# Altium project lab2_zhernakov_buck.PrjPcb
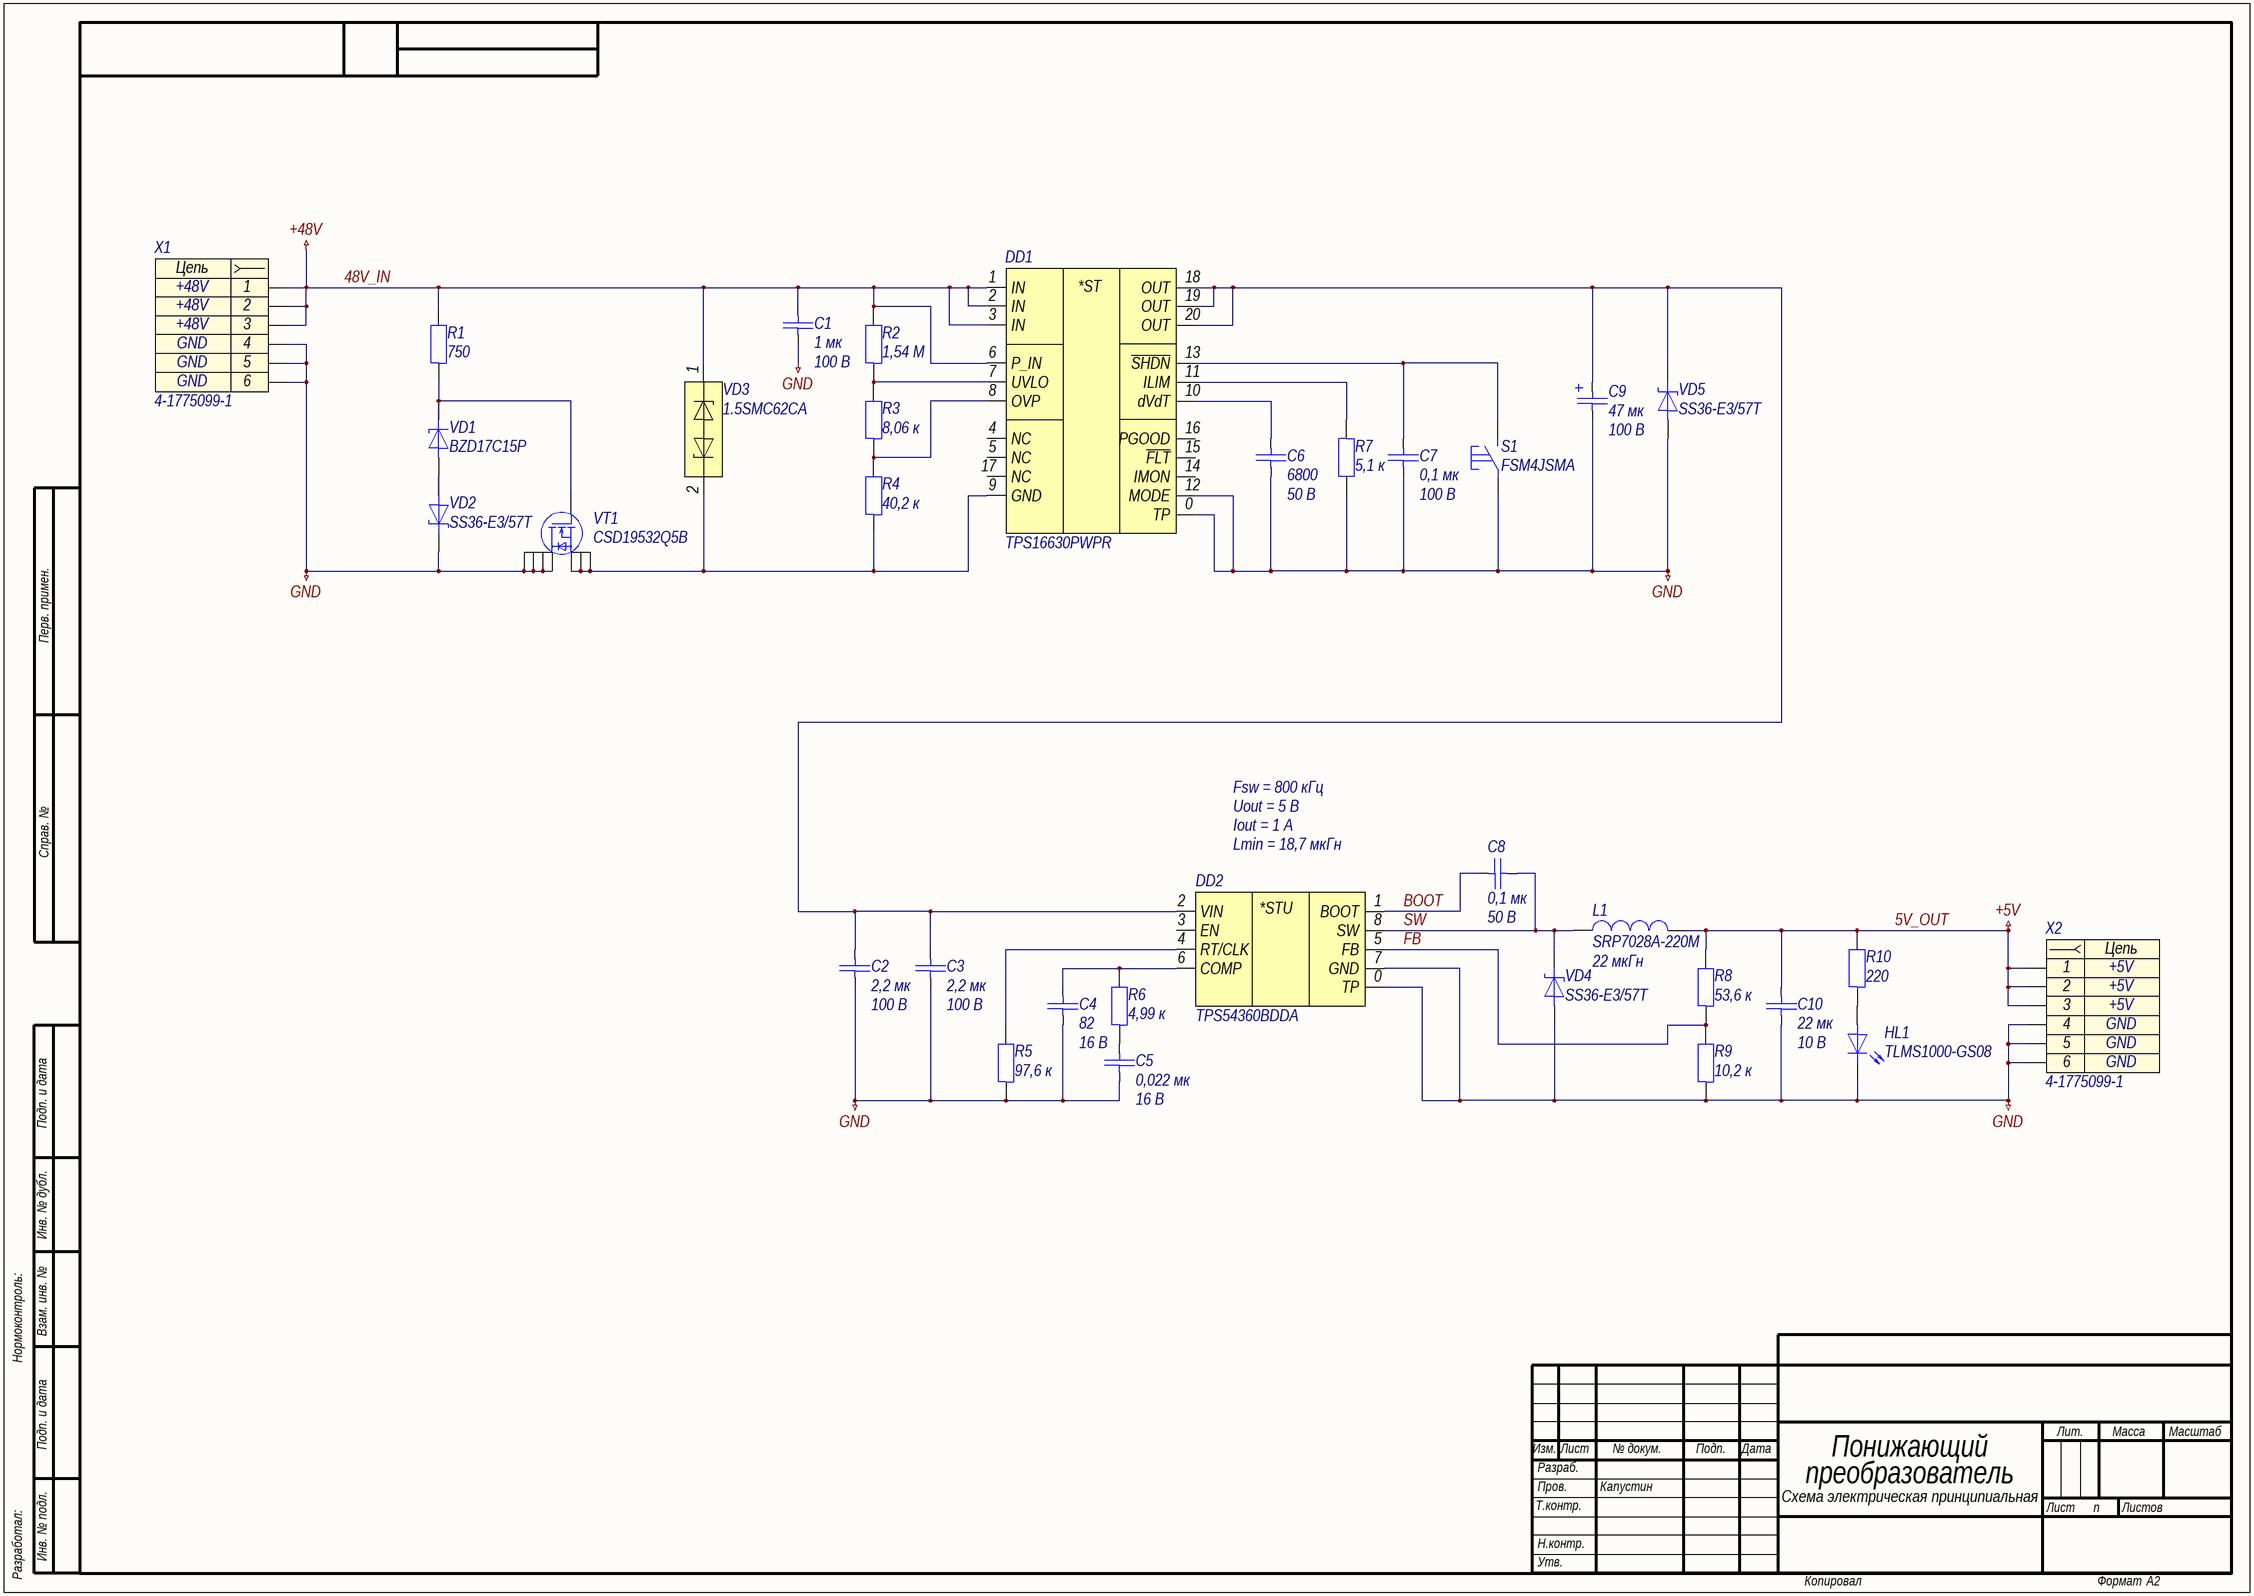
[diagram p0: lab2_zhernakov_buck.SchDoc]
approver: Капустин; check: Капустин; designation: СПБПУ.3331506.005; developer: Жернаков; document_code: Ý3; document_type: Схема электрическая принципиальная; pcb_dec_number: СПБПУ.3331506.005; project: Понижающий преобразователь; sheets_total: 1; title: Понижающий преобразователь; title_line_1: Понижающий; title_line_2: преобразователь
1 sheet, 33 parts. Net scope: global (net labels, ports and power ports of the same name join across sheets).
Board file: lab2_zhernakov_buck.PcbDoc

## Sheet lab2_zhernakov_buck.SchDoc: Понижающий преобразователь
size 594 x 420 mm; ApprovedBy: Капустин; CheckedBy: Капустин; DrawnBy: Жернаков; DocumentNumber: СПБПУ.3331506.005Ý3; SheetNumber: n; SheetTotal: 1; DocumentCode: Ý3; ImagePath: СПБПУ.3331506.005

### Parts
C1  1 мк  Напряжение: 100 В  [C1206]
C2  2,2 мк  Напряжение: 100 В  [C1206]
C3  2,2 мк  Напряжение: 100 В  [C1206]
C4  82  Напряжение: 16 В  [C0603]
C5  0,022 мк  Напряжение: 16 В  [C0201]
C6  6800  Напряжение: 50 В  [C0402]
C7  0,1 мк  Напряжение: 100 В  [C0603]
C8  0,1 мк  Напряжение: 50 В  [C0603]
C9  47 мк  Напряжение: 100 В  [CAPAE-1000X1000X1200]
C10  22 мк  Напряжение: 10 В  [C0603]
DD1  TPS16630PWPR  [HTSSOP-20]
DD2  TPS54360BDDA  [HSOIC-8]
HL1  TLMS1000-GS08  [HL0603]
L1  SRP7028A-220M  Индуктивность: 22 мкГн  [SRP-2-670X660X280]
R1  750  [R0603]
R2  1,54 М  [R0603]
R3  8,06 к  [R0603]
R4  40,2 к  [R0603]
R5  97,6 к  [R0603]
R6  4,99 к  [R0603]
R7  5,1 к  [R0603]
R8  53,6 к  [R0603]
R9  10,2 к  [R0603]
R10  220  [R0603]
S1  FSM4JSMA  [FSM4JSMA]
VD1  BZD17C15P  [DO-219AB]
VD2  SS36-E3/57T  [DO-214AB]
VD3  1.5SMC62CA  [DO-214AB]
VD4  SS36-E3/57T  [DO-214AB]
VD5  SS36-E3/57T  [DO-214AB]
VT1  CSD19532Q5B  [SON-8]
X1  4-1775099-1  [4-1775099-1]
X2  4-1775099-1  [4-1775099-1]

### Nets
5V_OUT: C10.1 L1.2 R8.2 R10.2 X2.1 X2.2 X2.3  [also labelled +5V]
48V_IN: C1.1 DD1.1(IN) DD1.2(IN) DD1.3(IN) DD1.6(P_IN) R1.2 R2.2 VD3.1 X1.1 X1.2 X1.3  [also labelled +48V]
GND: C1.2 C2.2 C3.2 C4.2 C5.2 C6.2 C7.2 C9.2 C10.2 DD1.0(TP) DD1.12(MODE) DD2.0(TP) DD2.7(GND) HL1.1 R5.1 R7.2 R9.1 S1.1 VD2.1 VD4.2 VD5.2 VT1.D X1.4 X1.5 X1.6 X2.4 X2.5 X2.6
BOOT: C8.2 DD2.1(BOOT)
FB: DD2.5(FB) R8.1 R9.2
SW: C8.1 DD2.8(SW) L1.1 VD4.1
NetC2_1: C2.1 C3.1 C9.1 DD1.18(OUT) DD1.19(OUT) DD1.20(OUT) DD2.2(VIN) VD5.1
NetC4_1: C4.1 DD2.6(COMP) R6.2
NetC5_1: C5.1 R6.1
NetC6_1: C6.1 DD1.10(dVdT)
NetC7_1: C7.1 DD1.13(~{SHDN}) S1.2
NetDD1_7: DD1.7(UVLO) R2.1 R3.2
NetDD1_8: DD1.8(OVP) R3.1 R4.2
NetDD1_9: DD1.9(GND) R4.1 VD3.2 VT1.S
NetDD1_11: DD1.11(ILIM) R7.1
NetDD2_4: DD2.4(RT/CLK) R5.2
NetHL1_2: HL1.2 R10.1
NetR1_1: R1.1 VD1.1 VT1.G
NetVD1_2: VD1.2 VD2.2

Not connected (* = marked no-connect by the designer): DD1 4(NC) 5(NC) 14(IMON) 15(~{FLT}) 16(PGOOD) 17(NC); DD2 3(EN)

### Notes on the sheet
- Fsw = 800 кГц
- Uout = 5 В
- Iout = 1 А
- Lmin = 18,7 мкГн
- Перв. примен.
- Справ. №
- Подп. и дата
- Инв. № дубл.
- Нормоконтроль:
- Взам. инв. №
- Изм.
- Лист
- № докум.
- Подп.
- Дата
- Лит.
- Масса
- Масштаб
- Т.контр.
- Пров.
- Разраб.
- Листов
- Разработал:
- Инв. № подл.
- Н.контр.
- Утв.
- Копировал
- Формат
- А2
- (in symbol dd0002) *STU; *ST
- (in symbol x0005) Цепь

### Library data of the parts
C1 = c0068: =Описание; ID: c0068; Фамилия: Ларионов; Описание: Конденсатор чип 1206 1 мкФ 100 В ±10 %; Наименование: CC1206KKX7R0BB105; Производитель: YAGEO Corp.; Отклонение: ±10 %; Рабочие температуры: от –55 °С до +125 °С; Температурный коэффициент емкости: X7R; Корпус: 1206; Номинал: 1 мк; Номинальное напряжение: 100 В; HelpURL: https://www.yageo.com/upload/media/product/productsearch/datasheet/mlcc/UPY-NP0X7R_MV_100-to-630V_22.pdf
C2 C3 = c0068: =Описание; ID: c0068; Фамилия: Ларионов; Описание: Конденсатор чип 1206 2,2 мкФ 100 В ±10 %; Наименование: CC1206KKX7R0BB225; Производитель: YAGEO Corp.; Отклонение: ±10 %; Рабочие температуры: от –55 °С до +125 °С; ТКЕ: X7R; Корпус: 1206; Номинал: 2,2 мк; Номинальное напряжение: 100 В; HelpURL: https://www.yageo.com/upload/media/product/productsearch/datasheet/mlcc/UPY-NP0X7R_MV_100-to-630V_22.pdf
C4 = c0011: =Описание; ID: c0011; Фамилия: Ларионов; Описание: Конденсатор чип 0603 82 пФ 16 В ±5 %; Наименование: CC0603JRNPO7BN820; Производитель: YAGEO Corp.; Отклонение: ±5 %; Рабочие температуры: от –55 °С до +125 °С; Температурный коэффициент емкости: C0G; Корпус: 0603; Номинал: 82; Номинальное напряжение: 16 В; HelpURL: https://www.yageo.com/upload/media/product/productsearch/datasheet/mlcc/UPY-GP_NP0_16V-to-50V_18.pdf
C5 = c0024: =Описание; ID: c0024; Фамилия: Жернаков; Описание: Конденсатор чип 0201 22 нФ 16 В ±10 %; Наименование: CC0201KRX5R7BB223; Производитель: YAGEO Corp.; Отклонение: ±10 %; Рабочие температуры: от –55 °С до +85 °С; Температурный коэффициент емкости: X5R; Корпус: 0201; Номинал: 0,022 мк; Номинальное напряжение: 16 В; HelpURL: https://www.yageo.com/upload/media/product/productsearch/datasheet/mlcc/UPY-GPHC_X5R_4V-to-50V_26.pdf
C6 = c0005: =Описание; ID: c0005; Фамилия: Жернаков; Описание: Конденсатор чип 0402 6,8 нФ 50 В ±5 %; Наименование: CL05B682JB5NNNC; Производитель: Samsung electro-mechanics; Отклонение: ±5 %; Рабочие температуры: от –55 °С до +125 °С; Температурный коэффициент емкости: C0G; Корпус: 0402; Номинал: 6800; Номинальное напряжение: 50 В; HelpURL: http://product.samsungsem.com/mlcc/CL05B682JB5NNN.do
C7 = c0038: =Описание; ID: c0038; Фамилия: Ларионов; Описание: Конденсатор чип 0603 100 нФ 100 В ±10 %; Наименование: CC0603KRX7R0BB104; Производитель: YAGEO Corp.; Отклонение: ±10 %; Рабочие температуры: от –55 °С до +125 °С; Температурный коэффициент емкости: X7R; Корпус: 0603; Номинал: 0,1 мк; Номинальное напряжение: 100 В; HelpURL: https://www.yageo.com/upload/media/product/productsearch/datasheet/mlcc/UPY-NP0X7R_MV_100-to-630V_22.pdf
C8 = c0027: =Описание; ID: c0027; Фамилия: Паньков; Описание: Конденсатор чип 0603 0,1 мкФ 50 В ±10 %; Наименование: CC0603KRX7R9BB104; Производитель: YAGEO Corp.; Отклонение: ±10 %; Рабочие температуры: от –55 °С до +125 °С; ТКЕ: X7R; Корпус: 0603; Номинал: 0,1 мк; Номинальное напряжение: 50 В; HelpURL: https://www.yageo.com/upload/media/product/products/datasheet/mlcc/UPY-GPHC_X7R_6.3V-to-50V_20.pdf
C9 = c0118: =Описание; ID: c0118; Фамилия: Ларионов; Описание: Конденсатор электролитический 47 мкФ 100 В ±20 %; Наименование: MAL214699904E3; Производитель: Vishay Intertechnology, Inc.; Отклонение: ±20 %; Рабочие температуры: от –55 °С до +125 °С; Корпус: CAPAE (10 x 10 x 12); Номинал: 47 мк; Номинальное напряжение: 100 В; Температурный коэффициент емкости: -; HelpURL: https://www.vishay.com/capacitors/list/product-28403/
C10 = c0101: =Описание; ID: c0101; Фамилия: Чернов; Описание: Конденсатор чип 0603 22 мкФ 10 В ±20 %; Наименование: CC0603MPX5R6BB226; Производитель: YAGEO Corp.; Отклонение: ±20 %; Рабочие температуры: от –55 °С до +85 °С; Температурный коэффициент емкости: X5R; Корпус: 0603; Номинал: 22 мк; Номинальное напряжение: 10 В; HelpURL: https://www.yageo.com/upload/media/product/productsearch/datasheet/mlcc/UPY-GPHC_X5R_4V-to-50V_26.pdf
DD1 = dd0002: =Описание; ID: dd0002; Фамилия: Жернаков; Описание: Защитная микросхема eFuse 60 В и 6 А; Производитель: Texas Instruments; Напряжение: от 4,5 В до 60 В; Максимальное напряжение: 67 В; Ток: от 0,6 А до 6 А; Рабочие температуры: от -40 °С до +125 °С; Наименование: TPS16630PWPR; Корпус: HTSSOP-20; HelpURL: https://www.ti.com/product/TPS1663
DD2 = dd0002: =Описание; ID: dd0002; Фамилия: Жернаков; Описание: Понижающий преобразователь напряжения 60 В и 3,5 А; Производитель: Texas Instruments; Входное напряжение: от 4,5 В до 60 В; Выходное напряжение: от 1 В до 58,8 В; Коммутируемый ток: от 0 А до 3,5 А; Частота переключения: от 100 кГц до 2,5 МГц; Рабочие температуры: от -40 °С до +150 °С; Наименование: TPS54360BDDA; Корпус: HSOIC-8; HelpURL: https://www.ti.com/product/TPS54360B#product-details##params
HL1 = hl0001: =Описание; ID: hl0001; Фамилия: Ларионов; Описание: Светодиод чип 0603 красный; Производитель: Vishay Intertechnology, Inc.; Цвет: Red; Номинальная сила света: 4 мкд; Номинальная длина волны: 628 нм; Номинальный прямой ток: 15 мА; Номинальное падение напряжения: 1,8 В; Рассеиваемая мощность: 40 мВт; Рабочие температуры: от -40 °С до +100 °С; Корпус: 0603; Наименование: TLMS1000-GS08; HelpURL: https://www.vishay.com/leds/list/product-83172/
L1 = l0006: =Описание; ID: l0006; Фамилия: Ларионов; Описание: Катушка индуктивности 22 мкГн ±20 %; Производитель: Bourns, Inc.; Отклонение: ±20 %; Номинальное активное сопротивление: 165 мОм; Максимальное активное сопротивление: 190 мОм; Резонансная частота: 10 МГц; Номинальный ток (при нагреве на 20 °С/40 °С): 2 А; Ток насыщения: 3,5 А; Рабочее напряжение: не указано; Рабочие температуры: от –55 °С до +150 °С; Корпус: 6,7 x 6,6 x 2,8; Наименование: SRP7028A-220M; Номинал: 22 мкГн; HelpURL: https://www.bourns.com/products/magnetic-products/power-inductors-aec-q200-compliant/product/SRP7028A
R1 = r0028: =Описание; ID: r0028; Фамилия: Паньков; Описание: Резистор чип 0603 750 Ом ±1 % 0,1 Вт; Наименование: RC0603FR-07750RL; Производитель: YAGEO Corp.; Отклонение: ±1 %; Номинальное напряжение: 75 В; Рабочие температуры: от –55 °С до +155 °С; Номинальный ток: 1 А; Корпус: 0603; Номинал: 750; HelpURL: https://www.yageo.com/upload/media/product/productsearch/datasheet/rchip/PYu-RC_Group_51_RoHS_L_11.pdf
R2 = r0042: =Описание; ID: r0042; Фамилия: Жернаков; Описание: Резистор чип 0603 1,54 МОм ±1 % 0,1 Вт; Наименование: RC0603FR-071M54L; Производитель: YAGEO Corp.; Отклонение: ±1 %; Номинальное напряжение: 75 В; Рабочие температуры: от -55 °С до +155 °С; Номинальный ток: 1 А; Корпус: 0603; Номинал: 1,54 М; HelpURL: https://www.yageo.com/upload/media/product/productsearch/datasheet/rchip/PYu-RC_Group_51_RoHS_L_11.pdf
R3 = r0020: =Описание; ID: r0020; Фамилия: Жернаков; Описание: Резистор чип 0603 8,06 кОм ±1 % 0,1 Вт; Наименование: RC0603FR-078K06L; Производитель: YAGEO Corp.; Отклонение: ±1 %; Номинальное напряжение: 75 В; Рабочие температуры: от -55 °С до +155 °С; Номинальный ток: 1 А; Корпус: 0603; Номинал: 8,06 к; HelpURL: https://www.yageo.com/upload/media/product/productsearch/datasheet/rchip/PYu-RC_Group_51_RoHS_L_11.pdf
R4 = r0028: =Описание; ID: r0028; Фамилия: Жернаков; Описание: Резистор чип 0603 40,2 кОм ±1 % 0,1 Вт; Наименование: RC0603FR-0740K2L; Производитель: YAGEO Corp.; Отклонение: ±1 %; Номинальное напряжение: 75 В; Рабочие температуры: от -55 °С до +155 °С; Номинальный ток: 1 А; Корпус: 0603; Номинал: 40,2 к; HelpURL: https://www.yageo.com/upload/media/product/productsearch/datasheet/rchip/PYu-RC_Group_51_RoHS_L_11.pdf
R5 = r0029: =Описание; ID: r0029; Фамилия: Водорезов; Описание: Резистор чип 0603 97,6 кОм ±1 % 0,1 Вт; Наименование: RC0603FR-0797K6L; Производитель: YAGEO Corp.; Отклонение: ±1 %; Номинальное напряжение: 75 В; Рабочие температуры: от -55 °С до +155 °С; Номинальный ток: 1 А; Корпус: 0603; Номинал: 97,6 к; HelpURL: https://www.yageo.com/upload/media/product/productsearch/datasheet/rchip/PYu-RC_Group_51_RoHS_L_11.pdf
R6 = r0017: =Описание; ID: r0017; Фамилия: Жернаков; Описание: Резистор чип 0603 4,99 кОм ±1 % 0,1 Вт; Наименование: RC0603FR-074K99L; Производитель: YAGEO Corp.; Отклонение: ±1 %; Номинальное напряжение: 75 В; Рабочие температуры: от -55 °С до +155 °С; Номинальный ток: 1 А; Корпус: 0603; Номинал: 4,99 к; HelpURL: https://www.yageo.com/upload/media/product/productsearch/datasheet/rchip/PYu-RC_Group_51_RoHS_L_11.pdf
R7 = r0019: =Описание; ID: r0019; Фамилия: Жернаков; Описание: Резистор чип 0603 5,1 кОм ±1 % 0,1 Вт; Наименование: RC0603FR-075K1L; Производитель: YAGEO Corp.; Отклонение: ±1 %; Номинальное напряжение: 75 В; Рабочие температуры: от -55 °С до +155 °С; Номинальный ток: 1 А; Корпус: 0603; Номинал: 5,1 к; HelpURL: https://www.yageo.com/upload/media/product/productsearch/datasheet/rchip/PYu-RC_Group_51_RoHS_L_11.pdf
R8 = r0017: =Описание; ID: r0017; Фамилия: Жернаков; Описание: Резистор чип 0603 53,6 кОм ±0,1 % 0,1 Вт; Наименование: RC0603BR-0753K6L; Производитель: YAGEO Corp.; Отклонение: ±0,1 %; Номинальное напряжение: 75 В; Рабочие температуры: от -55 °С до +155 °С; Номинальный ток: 1 А; Корпус: 0603; Номинал: 53,6 к; HelpURL: https://www.yageo.com/upload/media/product/productsearch/datasheet/rchip/PYu-RC_Group_51_RoHS_L_11.pdf
R9 = r0014: =Описание; ID: r0014; Фамилия: Жернаков; Описание: Резистор чип 0603 10,2 кОм ±1 % 0,1 Вт; Наименование: RC0603FR-0710K2L; Производитель: YAGEO Corp.; Отклонение: ±1 %; Номинальное напряжение: 75 В; Рабочие температуры: от -55 °С до +155 °С; Номинальный ток: 1 А; Корпус: 0603; Номинал: 10,2 к; HelpURL: https://www.yageo.com/upload/media/product/productsearch/datasheet/rchip/PYu-RC_Group_51_RoHS_L_11.pdf
R10 = r0009: =Описание; ID: r0009; Фамилия: Ларионов; Описание: Резистор чип 0603 220 Ом ±1 % 0,1 Вт; Наименование: RC0603FR-07220RL; Производитель: YAGEO Corp.; Отклонение: ±1 %; Номинальное напряжение: 75 В; Рабочие температуры: от -55 °С до +155 °С; Номинальный ток: 1 А; Корпус: 0603; Номинал: 220; HelpURL: https://www.yageo.com/upload/media/product/productsearch/datasheet/rchip/PYu-RC_Group_51_RoHS_L_11.pdf
S1 = sw0001: =Описание; ID: sw0001; Фамилия: Паньков; Описание: Тактовая кнопка поверхностного монтажа; Производитель: TE Connectivity; Ток нагрузки: 50 мА @ 24 В; Сопротивление контакта: 100 мОм; Количество контактов: 4; Рабочие температуры: от –35 °С до +85 °С; Промывка: Разрешена; Корпус: 6,00x6,00x4,98; Наименование: FSM4JSMA; HelpURL: https://www.te.com/usa-en/product-4-1437565-1.html
VD1 = vd0016: =Описание; ID: vd0016; Фамилия: Жернаков; Описание: Стабилитрон 15 В; Производитель: Vishay Intertechnology, Inc.; Номинальное напряжение стабилизации: 15 В; Разброс напряжения стабилизации: 13,8...15,6 В; Номинальный ток стабилизации: 50 мА; Рабочие температуры: от –55 °С до +150 °С; Наименование: BZD17C15P; Корпус: DO-219AB; HelpURL: https://www.vishay.com/product?docid=85161
VD2 VD5 = vd0003: =Описание; ID: vd0003; Фамилия: Жернаков; Описание: Диод Шоттки 60 В 3 А; Производитель: Vishay Intertechnology, Inc.; Пиковое прямое напряжение: 0,75 В; Импульсное обратное напряжение: 60 В; Макс допустимый средний прямой ток: 3 А; Рабочие температуры: от -55 °С до +150 °С; Наименование: SS36-E3/57T; Корпус: DO-214AB; HelpURL: https://www.vishay.com/product?docid=88751
VD3 = vd0004: =Описание; ID: vd0004; Фамилия: Ларионов; Описание: Двунаправленная диодная сборка для подавления помех, 53 В; Производитель: Littelfuse, Inc.; Наименование: 1.5SMC62CA; Корпус: DO-214AB; HelpURL: https://www.littelfuse.com/products/tvs-diodes/surface-mount/1_5smc.aspx
VD4 = vd0003: =Описание; ID: vd0003; Фамилия: Жернаков; Описание: Диод Шоттки 60 В 3 А; Производитель: Vishay Intertechnology, Inc.; Пиковое прямое напряжение: 0,75 В; Импульсное обратное напряжение: 60 В; Макс допустимый средний прямой ток: 3 А; Рабочие температуры: от –55 °С до +150 °С; Наименование: SS36-E3/57T; Корпус: DO-214AB; HelpURL: https://www.vishay.com/product?docid=88751
VT1 = vt0001: =Описание; ID: vt0001; Фамилия: Жернаков; Описание: Транзистор полевой N-канальный 100 В 17 А; Производитель: Texas Instruments; Напряжение затвор-исток: ±20 В; Напряжение сток-исток: 100 В; Ток стока: 17 А; Сопротивление сток-исток: 0,0057 Ом; Рабочие температуры: от -55 °С до +150 °С; Наименование: CSD19532Q5B; Корпус: SON-8; HelpURL: https://www.ti.com/product/CSD19532Q5B?keyMatch=CSD19532Q5B&tisearch=Search-EN-everything&usecase=OPN
X1 = x0005: =Описание; Contact_1: +48V; Contact_4: GND; ID: x0005; Фамилия: Жернаков; Описание: ATX Power 6 pin гнездо прямой; Производитель: TE Connectivity; Contact_2: +48V; Contact_3: +48V; Contact_5: GND; Contact_6: GND; Наименование: 4-1775099-1; HelpURL: https://www.te.com/usa-en/product-4-1775099-1.html?q=ATX%2BPower&source=header
X2 = x0005: =Описание; Contact_1: +5V; Contact_4: GND; ID: x0005; Фамилия: Жернаков; Описание: ATX Power 6 pin гнездо прямой; Производитель: TE Connectivity; Contact_2: +5V; Contact_3: +5V; Contact_5: GND; Contact_6: GND; Наименование: 4-1775099-1; HelpURL: https://www.te.com/usa-en/product-4-1775099-1.html?q=ATX%2BPower&source=header